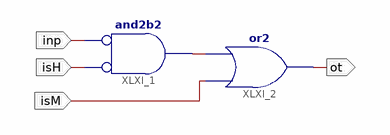
[diagram p0: schematic sheet 1]
// Xilinx ISE schematic SSDadef.sch (xc9500xl) as structural Verilog: 2 symbols, 4 ports
module SSDadef (
  input  isH,
  input  inp,
  input  isM,
  output ot
);

  wire XLXN_1;

  and XLXI_1 (XLXN_1, ~isH, ~inp);  // and2b2
  or XLXI_2 (ot, isM, XLXN_1);
endmodule
